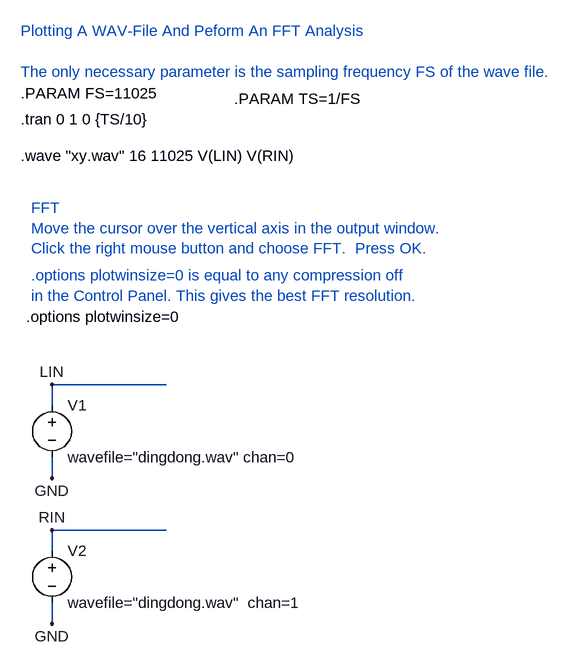
[diagram p0: schematic Wav_FFT1.asc]
Wav_FFT1.asc, the LTspice schematic file:
Version 4
SHEET 1 1932 1728
WIRE 672 848 672 816
WIRE 672 816 848 816
WIRE 672 624 672 592
WIRE 672 592 848 592
WIRE 672 928 672 960
WIRE 672 704 672 736
FLAG 672 736 GND
FLAG 672 960 GND
FLAG 672 592 LIN
FLAG 672 816 RIN
SYMBOL VOLTAGE 672 608 R0
SYMATTR InstName V1
SYMATTR Value wavefile="dingdong.wav" chan=0
SYMBOL voltage 672 832 R0
WINDOW 39 0 0 Left 0
WINDOW 123 0 0 Left 0
SYMATTR InstName V2
SYMATTR Value wavefile="dingdong.wav"  chan=1
TEXT 624 184 Left 0 !.tran 0 1 0 {TS/10}
TEXT 624 240 Left 0 !.wave "xy.wav" 16 11025 V(LIN) V(RIN)
TEXT 624 144 Left 0 !.PARAM FS=11025
TEXT 624 48 Left 0 ;Plotting A WAV-File And Peform An FFT Analysis\n \nThe only necessary parameter is the sampling frequency FS of the wave file.
TEXT 952 152 Left 0 !.PARAM TS=1/FS
TEXT 632 488 Left 0 !.options plotwinsize=0
TEXT 640 424 Left 0 ;.options plotwinsize=0 is equal to any compression off\nin the Control Panel. This gives the best FFT resolution.
TEXT 640 320 Left 0 ;FFT\nMove the cursor over the vertical axis in the output window.\nClick the right mouse button and choose FFT.  Press OK.

The netlist it stands for:
* Wav_FFT1.asc
V1 LIN GND wavefile="dingdong.wav" chan=0
V2 RIN GND wavefile="dingdong.wav"  chan=1
.tran 0 1 0 {TS/10}
.wave "xy.wav" 16 11025 V(LIN) V(RIN)
.PARAM FS=11025
* Plotting A WAV-File And Peform An FFT Analysis
* The only necessary parameter is the sampling frequency FS of the wave file.
.PARAM TS=1/FS
.options plotwinsize=0
* .options plotwinsize=0 is equal to any compression off
* in the Control Panel. This gives the best FFT resolution.
* FFT
* Move the cursor over the vertical axis in the output window.
* Click the right mouse button and choose FFT.  Press OK.
.backanno
.end